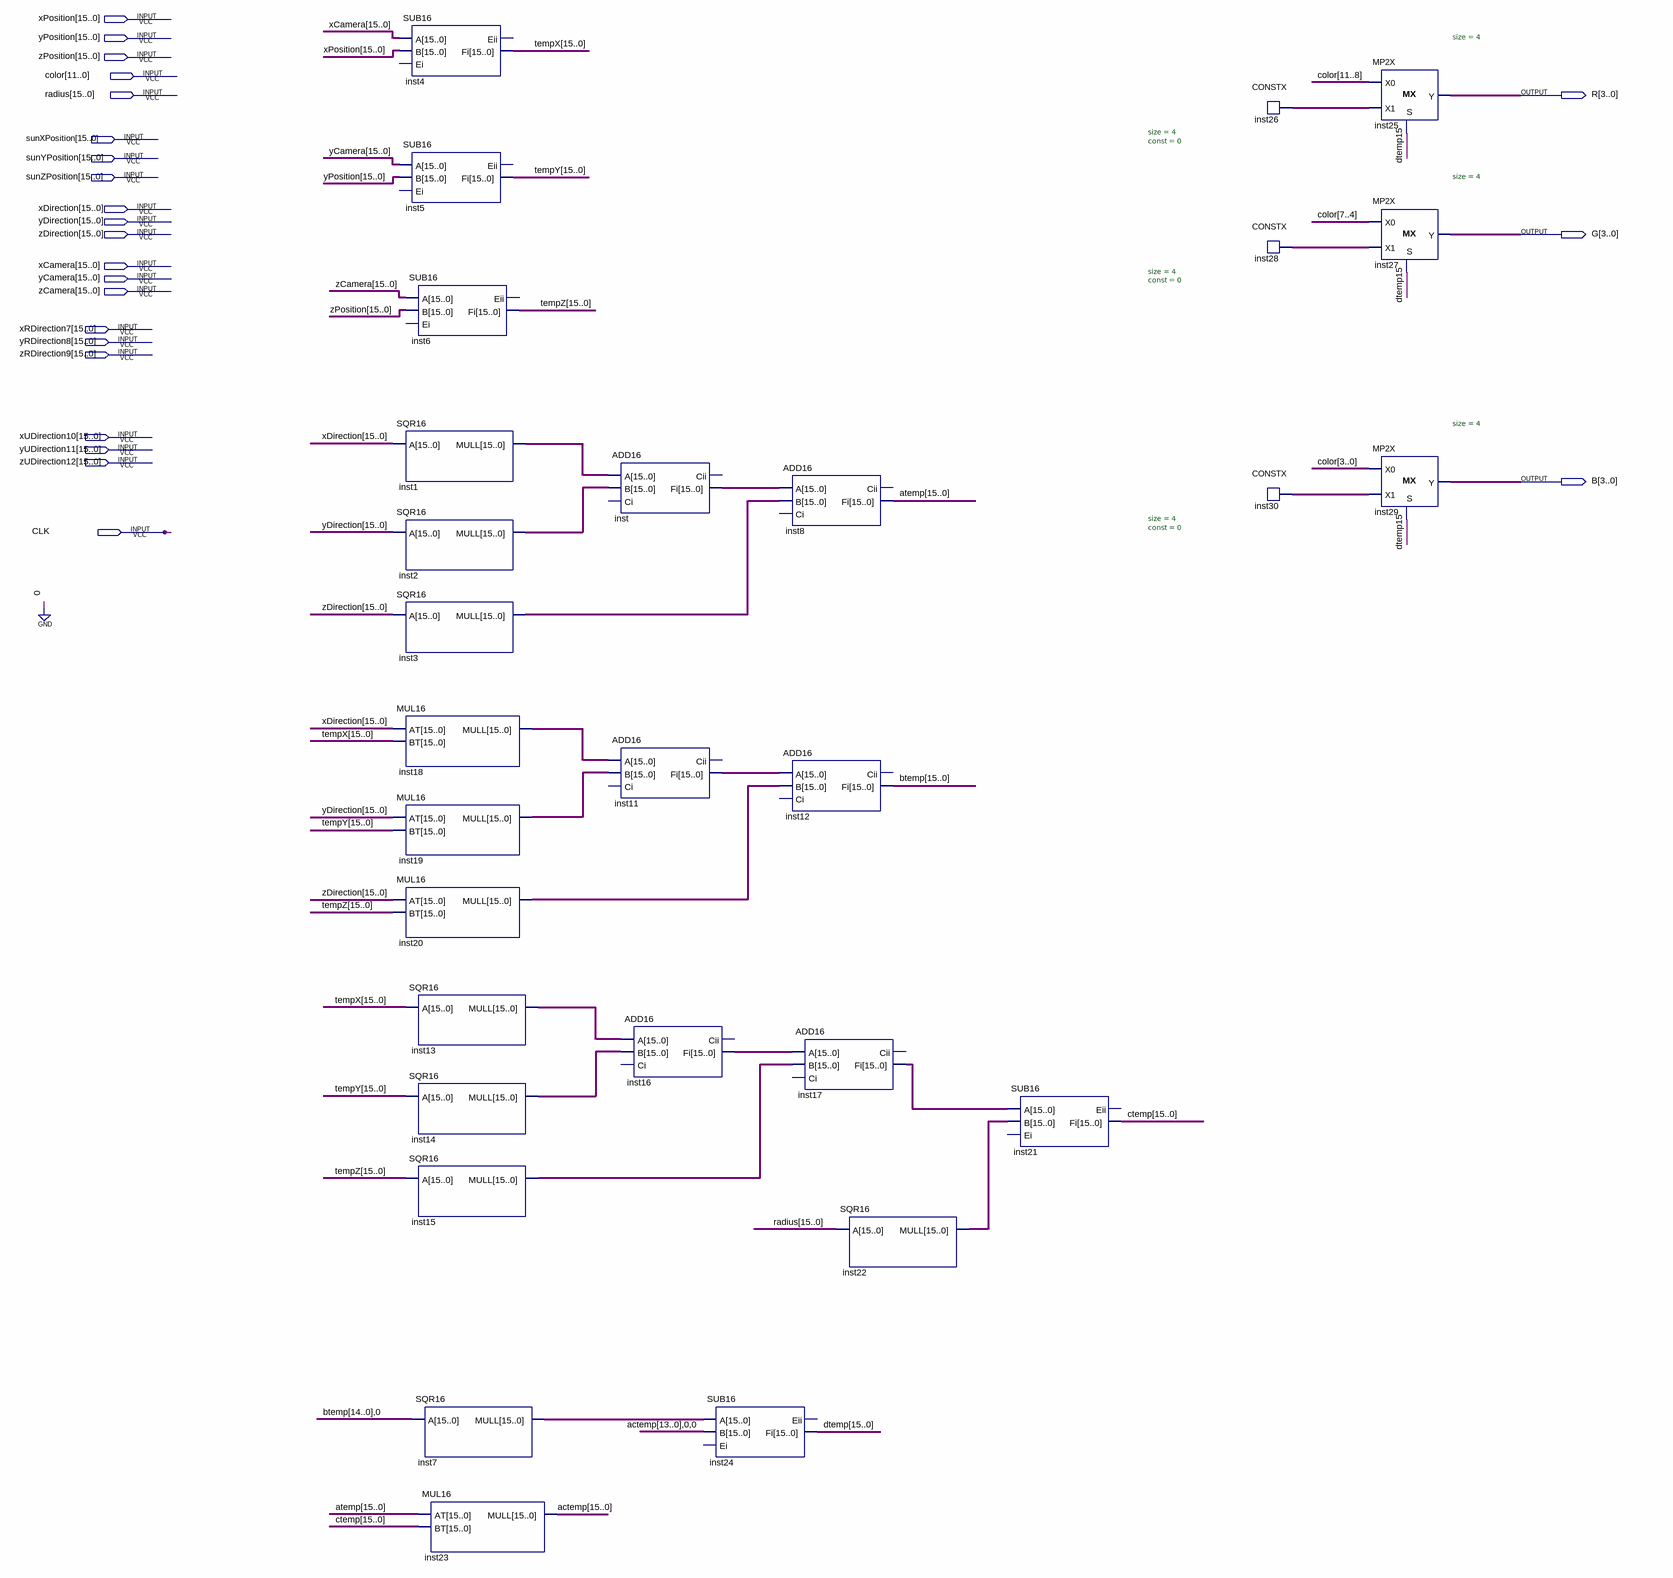
[diagram p0: schematic sheet]
// Quartus schematic planets.bdf as structural Verilog: 29 symbols, 24 pins
module planets (
  input  [15:0] xPosition,
  input  [15:0] yPosition,
  input  [15:0] zPosition,
  input  [11:0] color,
  input  [15:0] radius,
  input  [15:0] sunXPosition,
  input  [15:0] sunYPosition,
  input  [15:0] sunZPosition,
  input  [15:0] xDirection,
  input  [15:0] yDirection,
  input  [15:0] zDirection,
  input  [15:0] xCamera,
  input  [15:0] yCamera,
  input  [15:0] zCamera,
  input  [15:0] xRDirection7,
  input  [15:0] yRDirection8,
  input  [15:0] zRDirection9,
  input  [15:0] xUDirection10,
  input  [15:0] yUDirection11,
  input  [15:0] zUDirection12,
  input  CLK,
  output [3:0] R,
  output [3:0] G,
  output [3:0] B
);

  wire [3:0] inst26_data, inst28_data, inst30_data;
  wire [15:0] actemp, atemp, btemp, ctemp, dtemp, inst1_mull, inst2_mull, inst3_mull, inst7_mull, inst11_fi,
       inst13_mull, inst14_mull, inst15_mull, inst16_fi, inst17_fi, inst18_mull, inst19_mull, inst20_mull,
       inst22_mull, inst_fi, tempX, tempY, tempZ;

  SUB16 inst4 (.A(xCamera), .B(xPosition), .Fi(tempX));  // open: Ei, Eii
  SUB16 inst5 (.A(yCamera), .B(yPosition), .Fi(tempY));  // open: Ei, Eii
  SQR16 inst1 (.A(xDirection), .MULL(inst1_mull));
  SQR16 inst2 (.A(yDirection), .MULL(inst2_mull));
  SQR16 inst3 (.A(zDirection), .MULL(inst3_mull));
  MUL16 inst18 (.AT(xDirection), .BT(tempX), .MULL(inst18_mull));
  MUL16 inst19 (.AT(yDirection), .BT(tempY), .MULL(inst19_mull));
  MUL16 inst20 (.AT(zDirection), .BT(tempZ), .MULL(inst20_mull));
  SUB16 inst6 (.A(zCamera), .B(zPosition), .Fi(tempZ));  // open: Ei, Eii
  SQR16 inst13 (.A(tempX), .MULL(inst13_mull));
  SQR16 inst14 (.A(tempY), .MULL(inst14_mull));
  SQR16 inst15 (.A(tempZ), .MULL(inst15_mull));
  SQR16 inst7 (.A({btemp[14:0], 1'b0}), .MULL(inst7_mull));
  MUL16 inst23 (.AT(atemp), .BT(ctemp), .MULL(actemp));
  ADD16 inst (.A(inst1_mull), .B(inst2_mull), .Fi(inst_fi));  // open: Ci, Cii
  ADD16 inst11 (.A(inst18_mull), .B(inst19_mull), .Fi(inst11_fi));  // open: Ci, Cii
  ADD16 inst16 (.A(inst13_mull), .B(inst14_mull), .Fi(inst16_fi));  // open: Ci, Cii
  SUB16 inst24 (.A(inst7_mull), .B({actemp[13:0], 2'b00}), .Fi(dtemp));  // open: Ei, Eii
  ADD16 inst8 (.A(inst_fi), .B(inst3_mull), .Fi(atemp));  // open: Ci, Cii
  ADD16 inst12 (.A(inst11_fi), .B(inst20_mull), .Fi(btemp));  // open: Ci, Cii
  ADD16 inst17 (.A(inst16_fi), .B(inst15_mull), .Fi(inst17_fi));  // open: Ci, Cii
  SQR16 inst22 (.A(radius), .MULL(inst22_mull));
  SUB16 inst21 (.A(inst17_fi), .B(inst22_mull), .Fi(ctemp));  // open: Ei, Eii
  CONSTX #(.size(4), .\const (0)) inst26 (.data(inst26_data));
  CONSTX #(.size(4), .\const (0)) inst28 (.data(inst28_data));
  CONSTX #(.size(4), .\const (0)) inst30 (.data(inst30_data));
  MP2X #(.size(4)) inst25 (.S(dtemp[15]), .X0(color[11:8]), .X1(inst26_data), .Y(R));
  MP2X #(.size(4)) inst27 (.S(dtemp[15]), .X0(color[7:4]), .X1(inst28_data), .Y(G));
  MP2X #(.size(4)) inst29 (.S(dtemp[15]), .X0(color[3:0]), .X1(inst30_data), .Y(B));
endmodule
